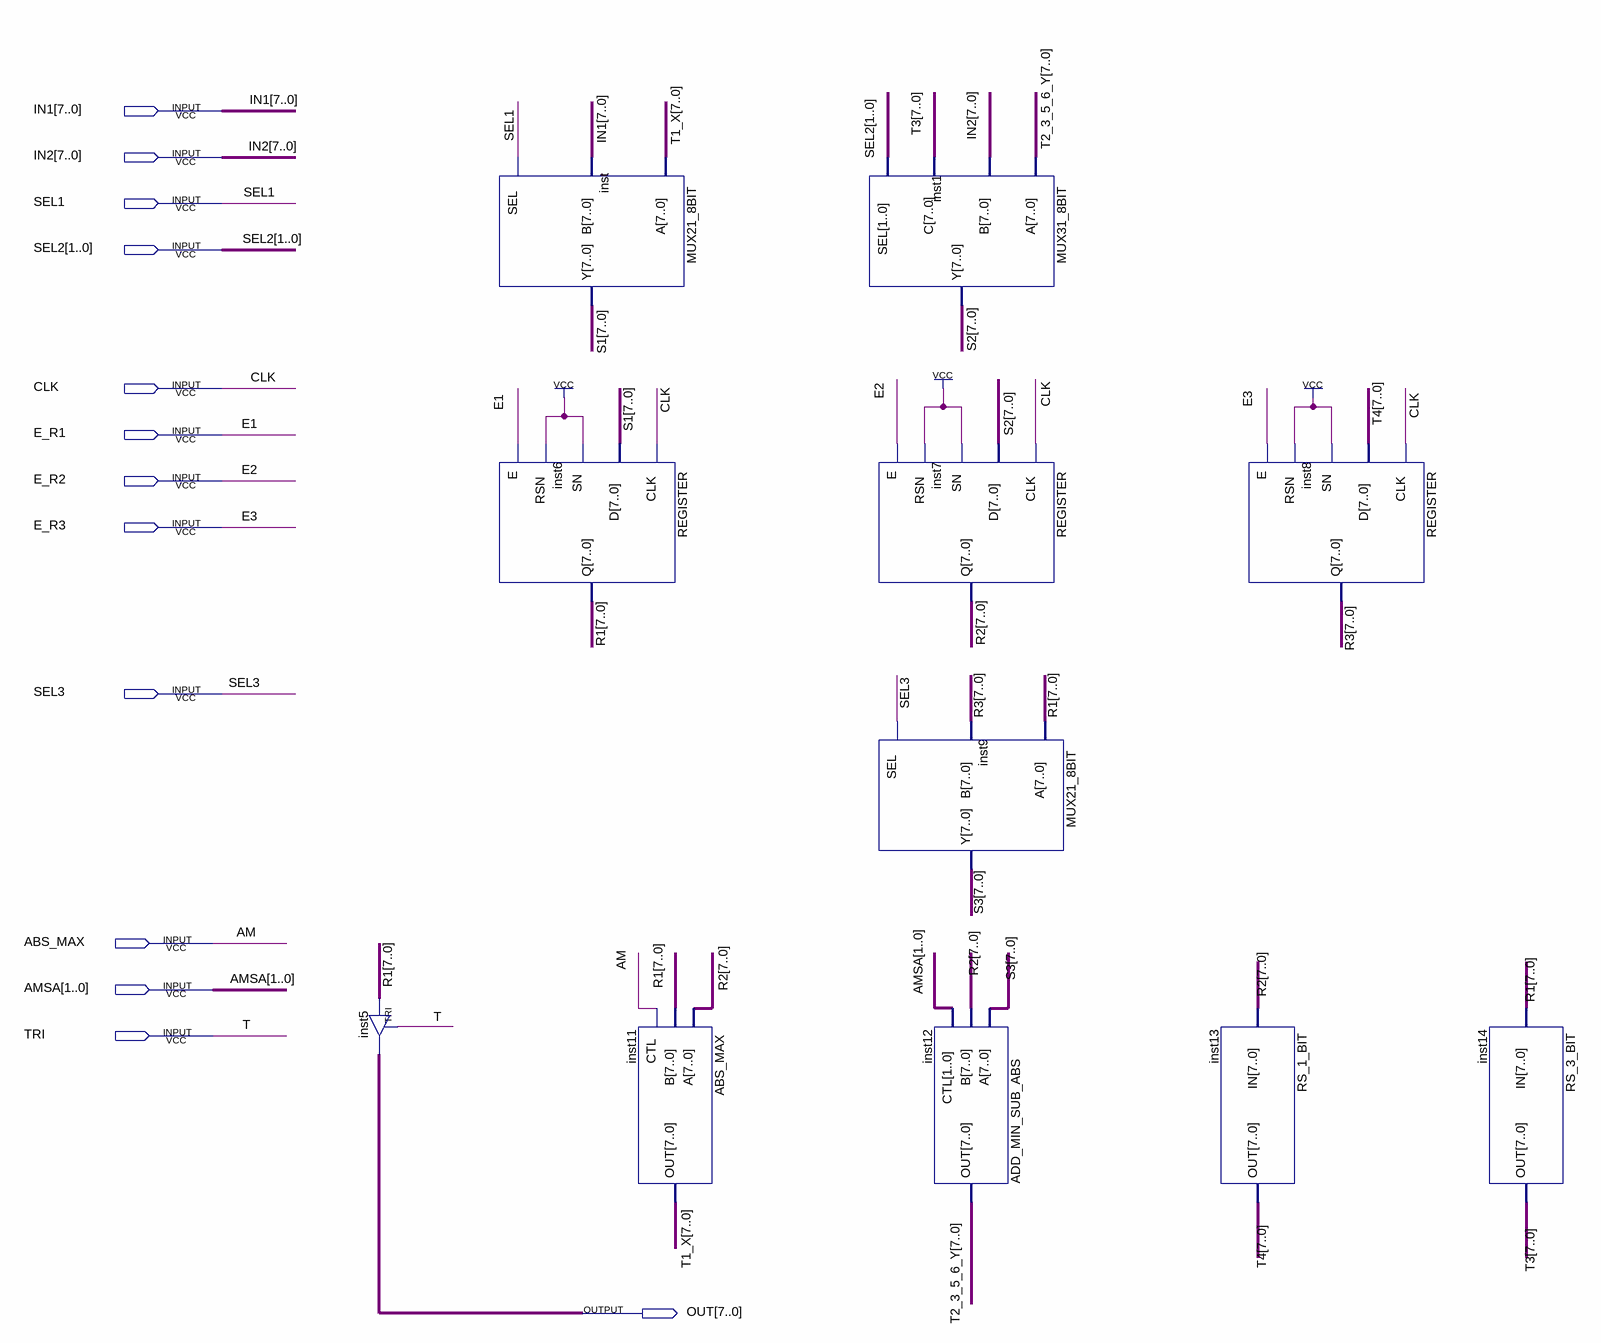
[diagram p0: schematic sheet]
// Quartus schematic Functional_Unit_Sharing_datapath.bdf as structural Verilog: 11 symbols, 13 pins
module Functional_Unit_Sharing_datapath (
  input  [7:0] IN1,
  input  [7:0] IN2,
  input  SEL1,
  input  [1:0] SEL2,
  input  CLK,
  input  E_R1,
  input  E_R2,
  input  E_R3,
  input  SEL3,
  input  ABS_MAX,
  input  [1:0] AMSA,
  input  TRI,
  output [7:0] OUT
);

  wire [7:0] R1, R2, R3, S1, S2, S3, T1_X, T2_3_5_6_Y, T3, T4;

  TRI inst5[7:0] (.IN(R1), .OE(TRI), .OUT(OUT));
  MUX21_8BIT inst (.A(T1_X), .B(IN1), .SEL(SEL1), .Y(S1));
  REGISTER inst6 (.CLK(CLK), .D(S1), .SN(1'b1), .RSN(1'b1), .E(E_R1), .Q(R1));
  ABS_MAX inst11 (.A(R2), .B(R1), .CTL(ABS_MAX), .OUT(T1_X));
  MUX31_8BIT inst1 (.A(T2_3_5_6_Y), .C(T3), .B(IN2), .SEL(SEL2), .Y(S2));
  REGISTER inst7 (.CLK(CLK), .D(S2), .SN(1'b1), .RSN(1'b1), .E(E_R2), .Q(R2));
  MUX21_8BIT inst9 (.A(R1), .B(R3), .SEL(SEL3), .Y(S3));
  ADD_MIN_SUB_ABS inst12 (.A(S3), .B(R2), .CTL(AMSA), .OUT(T2_3_5_6_Y));
  RS_1_BIT inst13 (.IN(R2), .OUT(T4));
  REGISTER inst8 (.CLK(CLK), .D(T4), .SN(1'b1), .RSN(1'b1), .E(E_R3), .Q(R3));
  RS_3_BIT inst14 (.IN(R1), .OUT(T3));

  // Other names for the same wires on the sheet: AM = ABS_MAX; E1 = E_R1; E2 = E_R2; E3 = E_R3; T = TRI
endmodule
